# Altium schematic sheet DriveConnector.SchDoc
size A4; CompanyName: NTB; Organization: NTB Interstate University of Applied; Address1: Werdenbergstrasse 4; Address3: 9471 Buchs; Address4: Switzerland; Organization1: Sciences of Technology Buchs; Size: A4
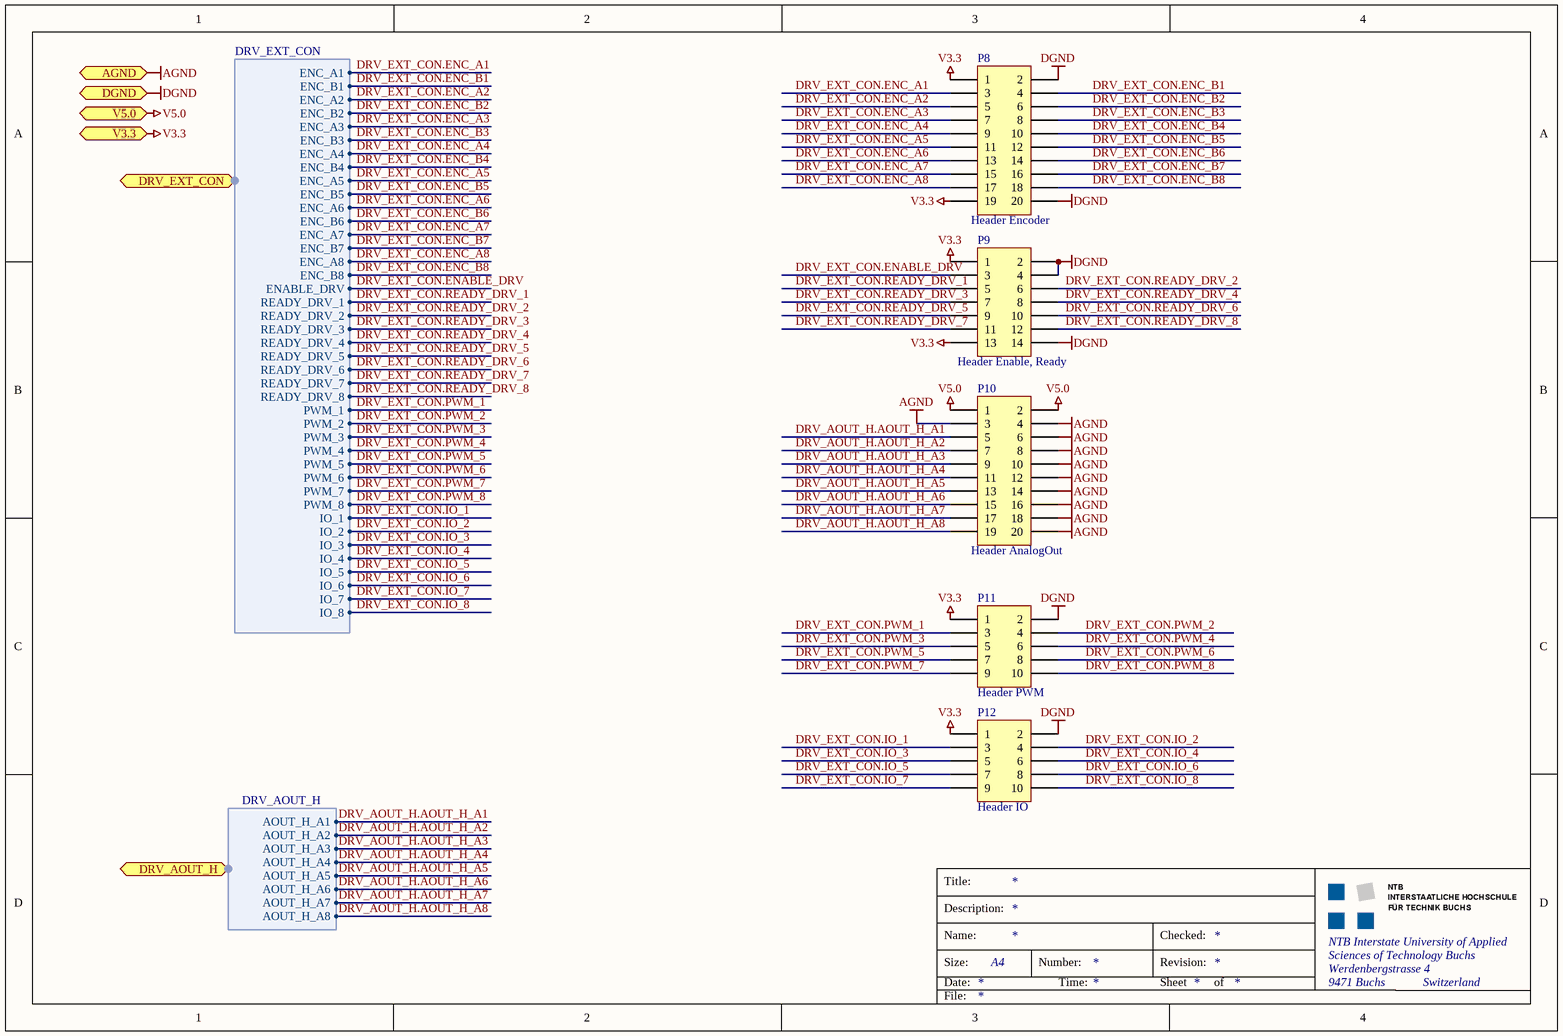
[diagram p0: DriveConnector.SchDoc]

## Parts
P8  Header Encoder  [Wannenstecker 2x10 - H]
P9  Header Enable, Ready  [Wannenstecker 2x7 - H]
P10  Header AnalogOut  [Wannenstecker 2x10 - H]
P11  Header PWM  [Wannenstecker 2x5 - H]
P12  Header IO  [Wannenstecker 2x5 - H]

## Ports
AGND, DGND, DRV_AOUT_H (harness DRV_AOUT_H), DRV_EXT_CON (harness DRV_EXT_CON), V3.3, V5.0

## Harnesses
DRV_AOUT_H: AOUT_H_A1, AOUT_H_A2, AOUT_H_A3, AOUT_H_A4, AOUT_H_A5, AOUT_H_A6, AOUT_H_A7, AOUT_H_A8
DRV_EXT_CON: ENC_A1, ENC_B1, ENC_A2, ENC_B2, ENC_A3, ENC_B3, ENC_A4, ENC_B4, ENC_A5, ENC_B5, ENC_A6, ENC_B6, ENC_A7, ENC_B7, ENC_A8, ENC_B8, PWM_1, ENABLE_DRV, READY_DRV_4, READY_DRV_3, READY_DRV_2, READY_DRV_1, IO_1, IO_2, READY_DRV_5, READY_DRV_6, READY_DRV_7, READY_DRV_8, PWM_2, PWM_3, PWM_4, PWM_5, PWM_6, PWM_7, PWM_8, IO_3, IO_4, IO_5, IO_6, IO_7, IO_8

## Nets
AGND: P10.3 P10.4 P10.6 P10.8 P10.10 P10.12 P10.14 P10.16 P10.18 P10.20 ; port AGND
DGND: P8.2 P8.20 P9.2 P9.4 P9.14 P11.2 P12.2 ; port DGND
V3.3: P8.1 P8.19 P9.1 P9.13 P11.1 P12.1 ; port V3.3
V5.0: P10.1 P10.2 ; port V5.0
DRV_AOUT_H.AOUT_H_A1: P10.5 ; port DRV_AOUT_H.AOUT_H_A1
DRV_AOUT_H.AOUT_H_A2: P10.7 ; port DRV_AOUT_H.AOUT_H_A2
DRV_AOUT_H.AOUT_H_A3: P10.9 ; port DRV_AOUT_H.AOUT_H_A3
DRV_AOUT_H.AOUT_H_A4: P10.11 ; port DRV_AOUT_H.AOUT_H_A4
DRV_AOUT_H.AOUT_H_A5: P10.13 ; port DRV_AOUT_H.AOUT_H_A5
DRV_AOUT_H.AOUT_H_A6: P10.15 ; port DRV_AOUT_H.AOUT_H_A6
DRV_AOUT_H.AOUT_H_A7: P10.17 ; port DRV_AOUT_H.AOUT_H_A7
DRV_AOUT_H.AOUT_H_A8: P10.19 ; port DRV_AOUT_H.AOUT_H_A8
DRV_EXT_CON.ENABLE_DRV: P9.3 ; port DRV_EXT_CON.ENABLE_DRV
DRV_EXT_CON.ENC_A1: P8.3 ; port DRV_EXT_CON.ENC_A1
DRV_EXT_CON.ENC_A2: P8.5 ; port DRV_EXT_CON.ENC_A2
DRV_EXT_CON.ENC_A3: P8.7 ; port DRV_EXT_CON.ENC_A3
DRV_EXT_CON.ENC_A4: P8.9 ; port DRV_EXT_CON.ENC_A4
DRV_EXT_CON.ENC_A5: P8.11 ; port DRV_EXT_CON.ENC_A5
DRV_EXT_CON.ENC_A6: P8.13 ; port DRV_EXT_CON.ENC_A6
DRV_EXT_CON.ENC_A7: P8.15 ; port DRV_EXT_CON.ENC_A7
DRV_EXT_CON.ENC_A8: P8.17 ; port DRV_EXT_CON.ENC_A8
DRV_EXT_CON.ENC_B1: P8.4 ; port DRV_EXT_CON.ENC_B1
DRV_EXT_CON.ENC_B2: P8.6 ; port DRV_EXT_CON.ENC_B2
DRV_EXT_CON.ENC_B3: P8.8 ; port DRV_EXT_CON.ENC_B3
DRV_EXT_CON.ENC_B4: P8.10 ; port DRV_EXT_CON.ENC_B4
DRV_EXT_CON.ENC_B5: P8.12 ; port DRV_EXT_CON.ENC_B5
DRV_EXT_CON.ENC_B6: P8.14 ; port DRV_EXT_CON.ENC_B6
DRV_EXT_CON.ENC_B7: P8.16 ; port DRV_EXT_CON.ENC_B7
DRV_EXT_CON.ENC_B8: P8.18 ; port DRV_EXT_CON.ENC_B8
DRV_EXT_CON.IO_1: P12.3 ; port DRV_EXT_CON.IO_1
DRV_EXT_CON.IO_2: P12.4 ; port DRV_EXT_CON.IO_2
DRV_EXT_CON.IO_3: P12.5 ; port DRV_EXT_CON.IO_3
DRV_EXT_CON.IO_4: P12.6 ; port DRV_EXT_CON.IO_4
DRV_EXT_CON.IO_5: P12.7 ; port DRV_EXT_CON.IO_5
DRV_EXT_CON.IO_6: P12.8 ; port DRV_EXT_CON.IO_6
DRV_EXT_CON.IO_7: P12.9 ; port DRV_EXT_CON.IO_7
DRV_EXT_CON.IO_8: P12.10 ; port DRV_EXT_CON.IO_8
DRV_EXT_CON.PWM_1: P11.3 ; port DRV_EXT_CON.PWM_1
DRV_EXT_CON.PWM_2: P11.4 ; port DRV_EXT_CON.PWM_2
DRV_EXT_CON.PWM_3: P11.5 ; port DRV_EXT_CON.PWM_3
DRV_EXT_CON.PWM_4: P11.6 ; port DRV_EXT_CON.PWM_4
DRV_EXT_CON.PWM_5: P11.7 ; port DRV_EXT_CON.PWM_5
DRV_EXT_CON.PWM_6: P11.8 ; port DRV_EXT_CON.PWM_6
DRV_EXT_CON.PWM_7: P11.9 ; port DRV_EXT_CON.PWM_7
DRV_EXT_CON.PWM_8: P11.10 ; port DRV_EXT_CON.PWM_8
DRV_EXT_CON.READY_DRV_1: P9.5 ; port DRV_EXT_CON.READY_DRV_1
DRV_EXT_CON.READY_DRV_2: P9.6 ; port DRV_EXT_CON.READY_DRV_2
DRV_EXT_CON.READY_DRV_3: P9.7 ; port DRV_EXT_CON.READY_DRV_3
DRV_EXT_CON.READY_DRV_4: P9.8 ; port DRV_EXT_CON.READY_DRV_4
DRV_EXT_CON.READY_DRV_5: P9.9 ; port DRV_EXT_CON.READY_DRV_5
DRV_EXT_CON.READY_DRV_6: P9.10 ; port DRV_EXT_CON.READY_DRV_6
DRV_EXT_CON.READY_DRV_7: P9.11 ; port DRV_EXT_CON.READY_DRV_7
DRV_EXT_CON.READY_DRV_8: P9.12 ; port DRV_EXT_CON.READY_DRV_8

## Notes on the sheet
- Title:
- Description:
- Size:
- Date:
- Name:
- Number:
- Time:
- Revision:
- Sheet
- Checked:
- of
- File:

## Library data of the parts
P8 P10 = Header 10X2: Header, 10-Pin, Dual row; LatestRevisionDate: 17-Jul-2002; LatestRevisionNote: Re-released for DXP Platform.; Publisher: Altium Limited
P9 = Header 2x7: Header, 7-Pin, Dual row; LatestRevisionDate: 17-Jul-2002; LatestRevisionNote: Re-released for DXP Platform.; Publisher: Altium Limited
P11 P12 = Header 5X2: Header, 5-Pin, Dual row; LatestRevisionDate: 17-Jul-2002; LatestRevisionNote: Re-released for DXP Platform.; Publisher: Altium Limited